# EAGLE design pressure sensors (EAGLE 9.2.2)
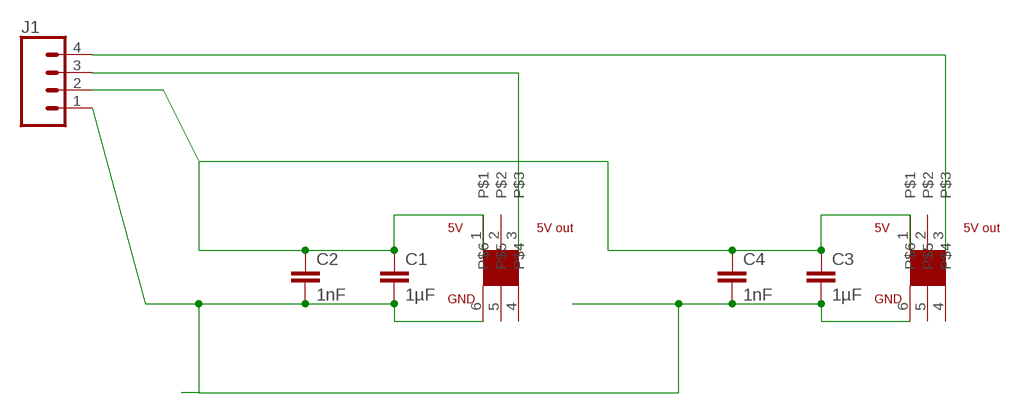
[diagram p0: schematic, sheet 1]

## Parts
C1  1µF  C-EU050-030X075  [C050-030X075]
C2  1nF  C-EU050-030X075  [C050-030X075]
C3  1µF  C-EU050-030X075  [C050-030X075]
C4  1nF  C-EU050-030X075  [C050-030X075]
J1  CONN_04  [1X04]
U$1  ADP5101  [DIP750W53P254L720H850Q6B]
U$2  ADP5101  [DIP750W53P254L720H850Q6B]

## Nets
5V: C1.1 C2.1 C3.1 C4.1 J1.2 U$1.1 U$2.1
GND: C1.2 C2.2 C3.2 C4.2 J1.1 U$1.6 U$2.6
N$3: J1.3 U$1.3
N$6: J1.4 U$2.3
Unconnected: U$1.2 U$1.4 U$1.5 U$2.2 U$2.4 U$2.5

## Library data of the parts
C1-C4 = rcl:C-EU: CAPACITOR, European symbol; SPICEPREFIX: C
J1 = SparkFun-Connectors:CONN_04: Multi connection point. Often used as Generic Header-pin footprint for 0.1 inch spaced/style header connections On any of the 0.1 inch spaced packages, you can populate with these: Break Away Headers - Straight <https://www.sparkfun.com/products/116> (PRT-00116) Break Away Male Headers - Right Angle <https://www.sparkfun.com/products/553> (PRT-00553) Female Headers <https://www.sparkfun.com/products/115> (PRT-00115) Break Away Headers - Machine Pin <https://www.sparkfun.com/products/117> (PRT-00117) Break Away Female Headers - Swiss Machine Pin <https://www.sparkfun.com/products/743> (PRT-00743) For SCREWTERMINALS and SPRING TERMINALS visit here: Screw Terimnals on SparkFun.com <https://www.sparkfun.com/search/results?term=Screw+Terminals> (5mm/3.5mm/2.54mm spacing) This device is also useful as a general connection point to wire up your design to another part of your project. Our various solder wires solder well into these plated through hole pads. Hook-Up Wire - Assortment (Stranded, 22 AWG) <https://www.sparkfun.com/products/11375> (PRT-11375) Hook-Up Wire - Assortment (Solid Core, 22 AWG) <https://www.sparkfun.com/products/11367> (PRT-11367) View the entire wire category on our website here <https://www.sparkfun.com/categories/141> Special notes: Molex polarized connector foot print use with SKU : PRT-08231 with associated crimp pins and housings. 1MM SMD Version SKU: PRT-10208; PROD_ID: CONN-09696
U$1 U$2 = local eagle library:ADP5101

## Board
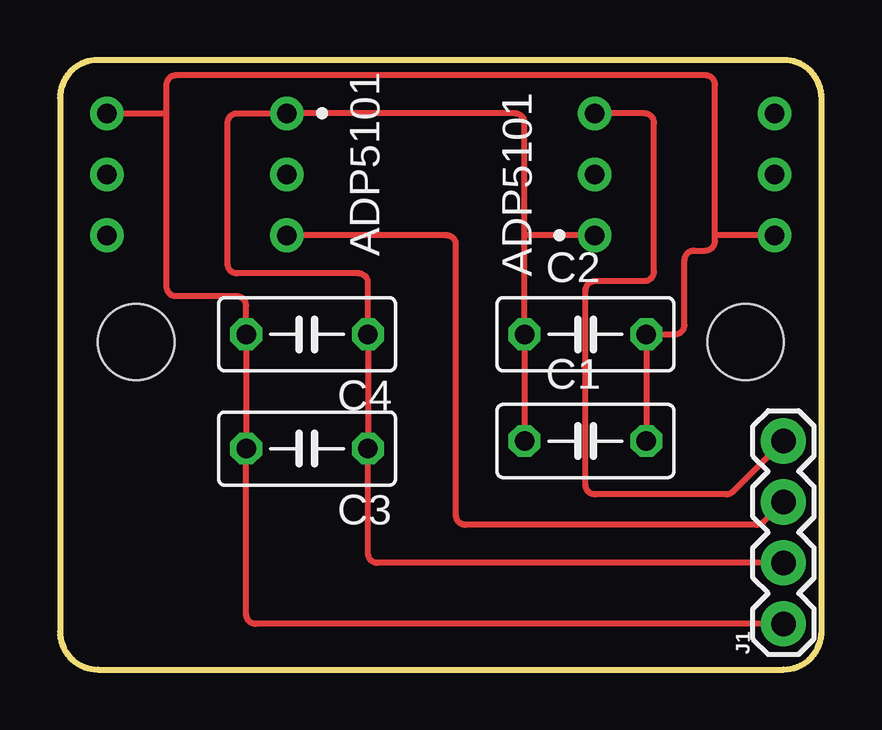
[diagram p1: board, top side]
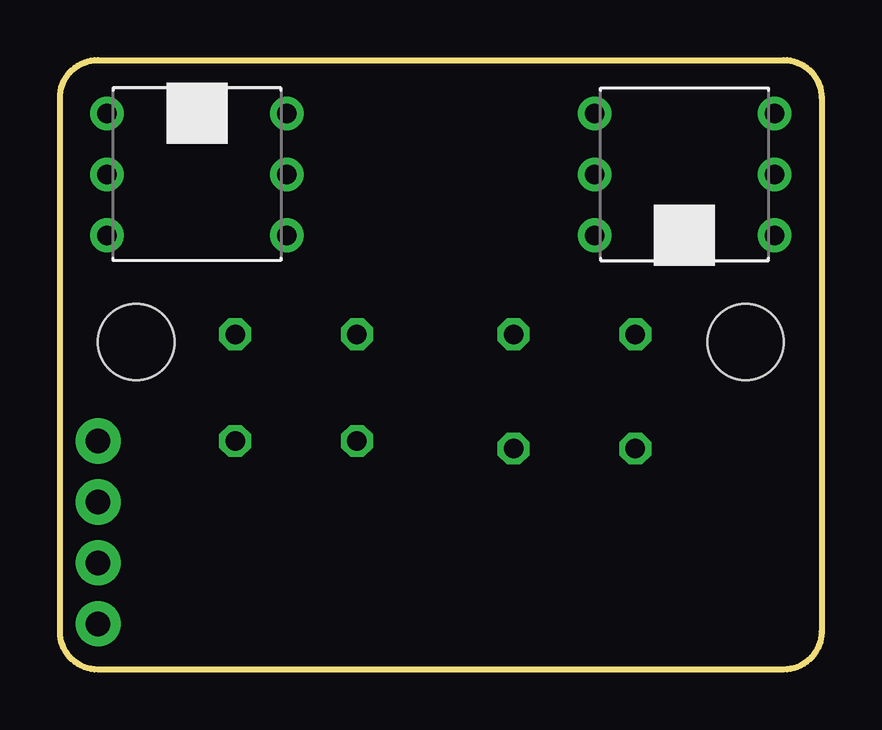
[diagram p2: board, bottom side, seen from below]

Size 31.75 x 25.4 mm. Coordinates in mm from the lower left corner, seen from the top.
Outline: 1.59,0 30.16,0 arc90 31.75,1.59 31.75,23.81 arc90 30.16,25.4 1.59,25.4 arc90 0,23.81 0,1.59 arc90 1.59,0
Copper layers (1*16): Top 0.035mm / dielectric 1.5mm / Bottom 0.035mm
Design rules "default": minimum track width 6mil, minimum drill 0.35mm, track to track 6mil, track to pad 6mil, pad to pad 6mil, via to via 6mil, smd to smd 6mil, copper to edge 40mil, drill to drill 6mil, minimum pad ring 10mil, minimum via ring 8mil, stop-mask expansion 4mil, vias tented up to drill 0mil, thermal gap 10mil
Holes 3.17 mm at 3.17,13.65 28.57,13.65

### Footprints (pad centres in the part's own frame; a part is rotated, then mirrored left to right if it is on the bottom)
C050-030X075 = drill 0.813 octagon: 1 -2.54,0; 2 2.54,0
1X04 = drill 1.016 pad 1.88: 1 0,0; 2 2.54,0; 3 5.08,0; 4 7.62,0
DIP750W53P254L720H850Q6B = drill 0.813 pad 1.397: 1 -2.54,3.75; 2 0,3.75; 3 2.54,3.75; 4 2.54,-3.75; 5 0,-3.75; 6 -2.54,-3.75

### Placement (x,y rotation side)
C1  21.91,9.52 0 top
C2  21.91,13.97 0 top
C3  10.3,9.21 180 top
C4  10.3,13.97 180 top
J1  30.16,1.91 90 top
U$1  5.71,20.64 270 top
U$2  26.04,20.64 90 top

### Tracks (layer width: path | path; a pad name or v marks a point on that pad's centre or on a via)
5V
  Top 0.254: J1.2 13.24,4.45 arc-90 12.84,4.84 C3.1 C4.1 12.84,16.11 arc90 12.45,16.51 7.38,16.51 arc-90 6.99,16.91 6.99,22.78 arc-90 7.38,23.18 U$1.1 18.97,23.18 arc-90 19.37,22.78 19.37,18.1 | C1.1 C2.1 19.37,18.1 | U$2.1 19.37,18.1
GND
  Top 0.254: J1.1 8.16,1.91 arc-90 7.76,2.3 C3.2 C4.2 7.76,15.16 arc90 7.37,15.56 4.84,15.56 arc-90 4.45,15.95 4.45,23.18 | 4.45,23.18 4.45,24.37 arc-90 4.84,24.76 26.91,24.76 arc-90 27.3,24.37 27.3,18.1 | U$1.6 4.45,23.18 | 27.3,18.1 27.3,17.86 arc-90 26.91,17.46 26.43,17.46 arc90 26.04,17.07 26.04,14.37 arc-90 25.64,13.97 C2.2 C1.2 | U$2.6 27.3,18.1
N$3
  Top 0.254: J1.3 29.33,6.15 arc-45 29.05,6.03 16.91,6.03 arc-90 16.51,6.43 16.51,17.7 arc90 16.11,18.1 U$1.3
N$6
  Top 0.254: U$2.3 24.37,23.18 arc-90 24.77,22.78 24.77,16.59 arc-90 24.37,16.19 22.3,16.19 arc90 21.91,15.8 21.91,7.7 arc90 22.3,7.3 27.78,7.3 arc45 28.06,7.42 J1.4